# Altium schematic sheet ADC.SchDoc
size A4
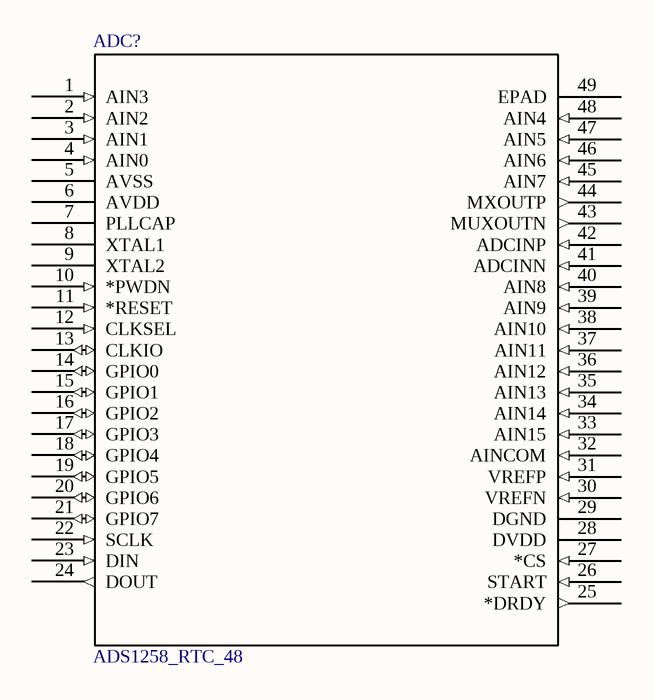
[diagram p0: ADC.SchDoc]

## Parts
ADC?  ADS1258_RTC_48  [RTC48_5P1X5P1 - weak]

## Nets

Not connected (* = marked no-connect by the designer): ADC? 1(AIN3) 2(AIN2) 3(AIN1) 4(AIN0) 5(AVSS) 6(AVDD) 7(PLLCAP) 8(XTAL1) 9(XTAL2) 10(*PWDN) 11(*RESET) 12(CLKSEL) 13(CLKIO) 14(GPIO0) 15(GPIO1) 16(GPIO2) 17(GPIO3) 18(GPIO4) 19(GPIO5) 20(GPIO6) 21(GPIO7) 22(SCLK) 23(DIN) 24(DOUT) 25(*DRDY) 26(START) 27(*CS) 28(DVDD) 29(DGND) 30(VREFN) 31(VREFP) 32(AINCOM) 33(AIN15) 34(AIN14) 35(AIN13) 36(AIN12) 37(AIN11) 38(AIN10) 39(AIN9) 40(AIN8) 41(ADCINN) 42(ADCINP) 43(MUXOUTN) 44(MXOUTP) 45(AIN7) 46(AIN6) 47(AIN5) 48(AIN4) 49(EPAD)

## Library data of the parts
ADC? = ADS1258_RTC_48: Imported; Manufacturer: Texas Instruments; INDUSTRY_STD_PKG_TYPE: VQFN; FAMILY_NAME: PRECISION ADC (<=10MSPS); PIN_COUNT: 48; PACKAGE_DESIGNATOR: RTC; Datasheet URL: http://www.ti.com/lit/gpn/ADS1258; GENERIC_PART_NUMBER: ADS1258; RefDes: RefDes; Type: DEV; Value: Value